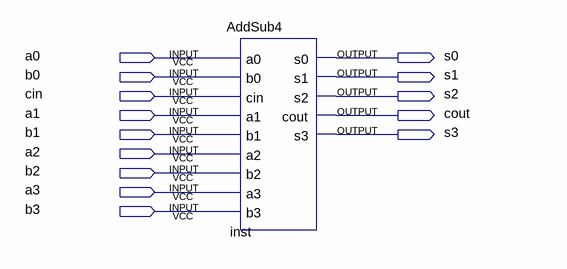
[diagram p0: schematic sheet]
// Quartus schematic AddSubDemo.bdf as structural Verilog: 1 symbols, 14 pins
module AddSubDemo (
  input  a0,
  input  b0,
  input  cin,
  input  a1,
  input  b1,
  input  a2,
  input  b2,
  input  a3,
  input  b3,
  output s0,
  output s1,
  output s2,
  output cout,
  output s3
);

  AddSub4 inst (
    .a0(a0), .b0(b0), .cin(cin), .a1(a1), .b1(b1), .a2(a2), .b2(b2), .a3(a3), .b3(b3), .s0(s0), .s1(s1),
    .s2(s2), .cout(cout), .s3(s3));
endmodule
